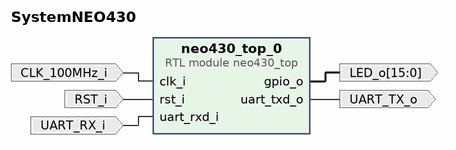
[diagram p0: block diagram of the top level]
# Vivado block design SystemNEO430, xc7a35tcpg236-1, Vivado 2021.2
create_bd_design SystemNEO430

create_bd_port -dir I -type clk CLK_100MHz_i
set_property -dict {CONFIG.FREQ_HZ 100000000} [get_bd_ports CLK_100MHz_i]
create_bd_port -dir I -type rst RST_i
set_property -dict {CONFIG.POLARITY ACTIVE_HIGH} [get_bd_ports RST_i]
create_bd_port -dir I -type data UART_RX_i
create_bd_port -dir O -type data UART_TX_o
create_bd_port -dir O -from 15 -to 0 -type data LED_o

create_bd_cell -type module -reference neo430_top neo430_top_0
set_property -dict [list \
  CONFIG.BOOTLD_USE true \
  CONFIG.CFU_USE false \
  CONFIG.CLOCK_SPEED 100000000 \
  CONFIG.CRC_USE false \
  CONFIG.EXIRQ_USE false \
  CONFIG.FREQ_GEN_USE false \
  CONFIG.MULDIV_USE false \
  CONFIG.SPI_USE false \
  CONFIG.TIMER_USE false \
  CONFIG.TWI_USE false \
  CONFIG.WB32_USE false \
  CONFIG.WDT_USE false \
] [get_bd_cells neo430_top_0]

# ---- connections ----

connect_bd_net [get_bd_ports CLK_100MHz_i] [get_bd_pins neo430_top_0/clk_i]
connect_bd_net [get_bd_ports RST_i] [get_bd_pins neo430_top_0/rst_i]
connect_bd_net [get_bd_ports UART_RX_i] [get_bd_pins neo430_top_0/uart_rxd_i]
connect_bd_net [get_bd_pins neo430_top_0/gpio_o] [get_bd_ports LED_o]
connect_bd_net [get_bd_pins neo430_top_0/uart_txd_o] [get_bd_ports UART_TX_o]

validate_bd_design
save_bd_design
